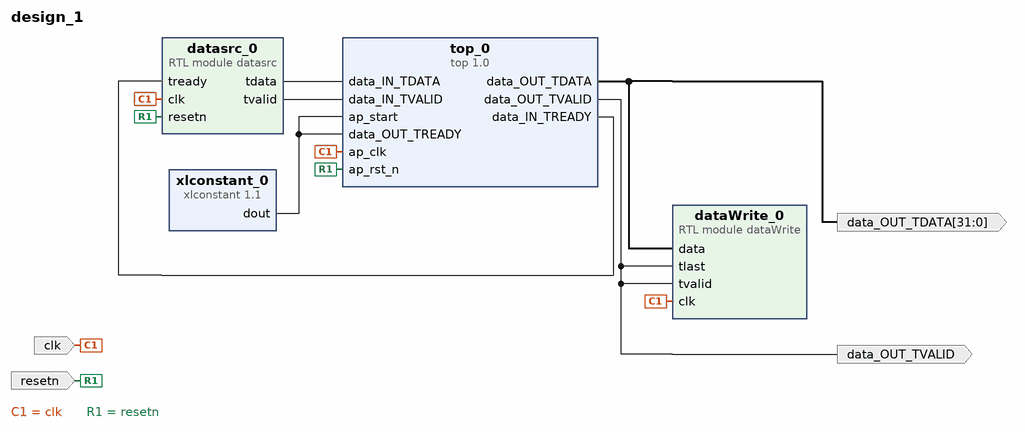
[diagram p0: block diagram of the top level]
# Vivado block design design_1, xc7z020clg484-1, Vivado 2020.2
create_bd_design design_1

create_bd_port -dir I -type clk clk
create_bd_port -dir I -type rst resetn
create_bd_port -dir O -from 31 -to 0 data_OUT_TDATA
create_bd_port -dir O data_OUT_TVALID

create_bd_cell -type ip -vlnv xilinx.com:hls:top:1.0 top_0
create_bd_cell -type ip -vlnv xilinx.com:ip:xlconstant:1.1 xlconstant_0
create_bd_cell -type module -reference datasrc datasrc_0
create_bd_cell -type module -reference dataWrite dataWrite_0

# ---- connections ----

connect_bd_net [get_bd_pins datasrc_0/tdata] [get_bd_pins top_0/data_IN_TDATA]
connect_bd_net [get_bd_pins top_0/data_IN_TREADY] [get_bd_pins datasrc_0/tready]
connect_bd_net [get_bd_pins datasrc_0/tvalid] [get_bd_pins top_0/data_IN_TVALID]
connect_bd_net -net clk_0_1 [get_bd_ports clk] [get_bd_pins top_0/ap_clk] [get_bd_pins datasrc_0/clk] [get_bd_pins dataWrite_0/clk]
connect_bd_net -net resetn_0_1 [get_bd_ports resetn] [get_bd_pins top_0/ap_rst_n] [get_bd_pins datasrc_0/resetn]
connect_bd_net [get_bd_pins xlconstant_0/dout] [get_bd_pins top_0/ap_start] [get_bd_pins top_0/data_OUT_TREADY]
connect_bd_net [get_bd_pins top_0/data_OUT_TDATA] [get_bd_ports data_OUT_TDATA] [get_bd_pins dataWrite_0/data]
connect_bd_net [get_bd_pins top_0/data_OUT_TVALID] [get_bd_ports data_OUT_TVALID] [get_bd_pins dataWrite_0/tvalid] [get_bd_pins dataWrite_0/tlast]

validate_bd_design
save_bd_design
